# Altium schematic sheet Top Level.SchDoc: ELEC5551 Telemetry PCB
size A4; Author: Team 15; DrawnBy: Team 15; Engineer: Team 15; SheetNumber: 1; SheetTotal: 6
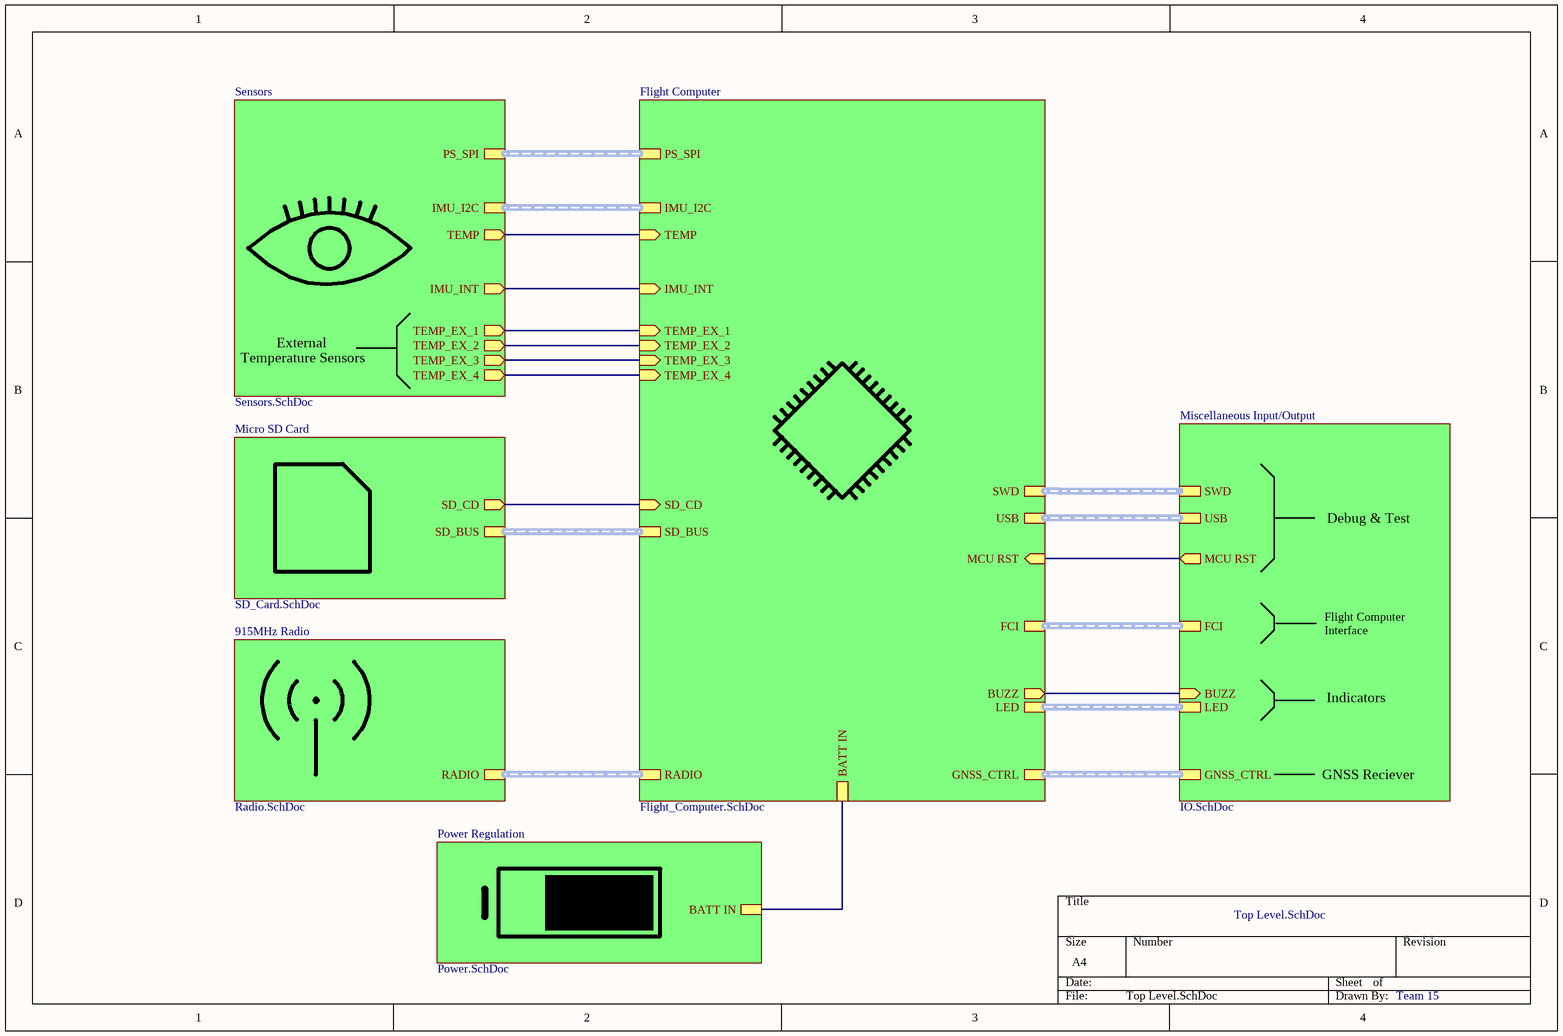
[diagram p0: Top Level.SchDoc]

## Sub-sheets
915MHz Radio = Radio.SchDoc: RADIO (harness RADIO)
Flight Computer = Flight_Computer.SchDoc: SD_CD (in), TEMP (in), IMU_INT (in), BUZZ (out), MCU RST (in), GNSS_CTRL (harness GNSS_CTRL), IMU_I2C (harness IMU_I2C), LED (harness LED), PS_SPI (harness PS_SPI), RADIO (harness RADIO), SD_BUS (harness SD_BUS), USB (harness USB), SWD (harness SWD), BATT IN, FCI (harness Flight Computer Interface), TEMP_EX_1 (in), TEMP_EX_2 (in), TEMP_EX_3 (in), TEMP_EX_4 (in)
Micro SD Card = SD_Card.SchDoc: SD_CD (out), SD_BUS (harness SD_BUS)
Miscellaneous Input/Output = IO.SchDoc: LED (harness LED), GNSS_CTRL (harness GNSS_CTRL), MCU RST (out), BUZZ (in), USB (harness USB), SWD (harness SWD), FCI (harness Flight Computer Interface)
Power Regulation = Power.SchDoc: BATT IN
Sensors = Sensors.SchDoc: TEMP (out), IMU_INT (out), PS_SPI (harness PS_SPI), IMU_I2C (harness IMU_I2C), TEMP_EX_1 (out), TEMP_EX_2 (out), TEMP_EX_3 (out), TEMP_EX_4 (out)

## Nets
(unnamed): sheet Flight Computer/SD_CD, sheet Micro SD Card/SD_CD
(unnamed): sheet Flight Computer/TEMP, sheet Sensors/TEMP
(unnamed): sheet Flight Computer/IMU_INT, sheet Sensors/IMU_INT
(unnamed): sheet Flight Computer/BUZZ, sheet Miscellaneous Input/Output/BUZZ
(unnamed): sheet Flight Computer/MCU RST, sheet Miscellaneous Input/Output/MCU RST
(unnamed): sheet Flight Computer/BATT IN, sheet Power Regulation/BATT IN
(unnamed): sheet Flight Computer/TEMP_EX_1, sheet Sensors/TEMP_EX_1
(unnamed): sheet Flight Computer/TEMP_EX_2, sheet Sensors/TEMP_EX_2
(unnamed): sheet Flight Computer/TEMP_EX_3, sheet Sensors/TEMP_EX_3
(unnamed): sheet Flight Computer/TEMP_EX_4, sheet Sensors/TEMP_EX_4

## Buses and harness runs
harness sheet 915MHz Radio/RADIO = sheet Flight Computer/RADIO
harness sheet Flight Computer/FCI = sheet Miscellaneous Input/Output/FCI
harness sheet Flight Computer/GNSS_CTRL = sheet Miscellaneous Input/Output/GNSS_CTRL
harness sheet Flight Computer/IMU_I2C = sheet Sensors/IMU_I2C
harness sheet Flight Computer/LED = sheet Miscellaneous Input/Output/LED
harness sheet Flight Computer/PS_SPI = sheet Sensors/PS_SPI
harness sheet Flight Computer/SD_BUS = sheet Micro SD Card/SD_BUS
harness sheet Flight Computer/SWD = sheet Miscellaneous Input/Output/SWD
harness sheet Flight Computer/USB = sheet Miscellaneous Input/Output/USB

## Notes on the sheet
- Temperature Sensors
- External
- Debug & Test
- Flight Computer Interface
- Indicators
- GNSS Reciever